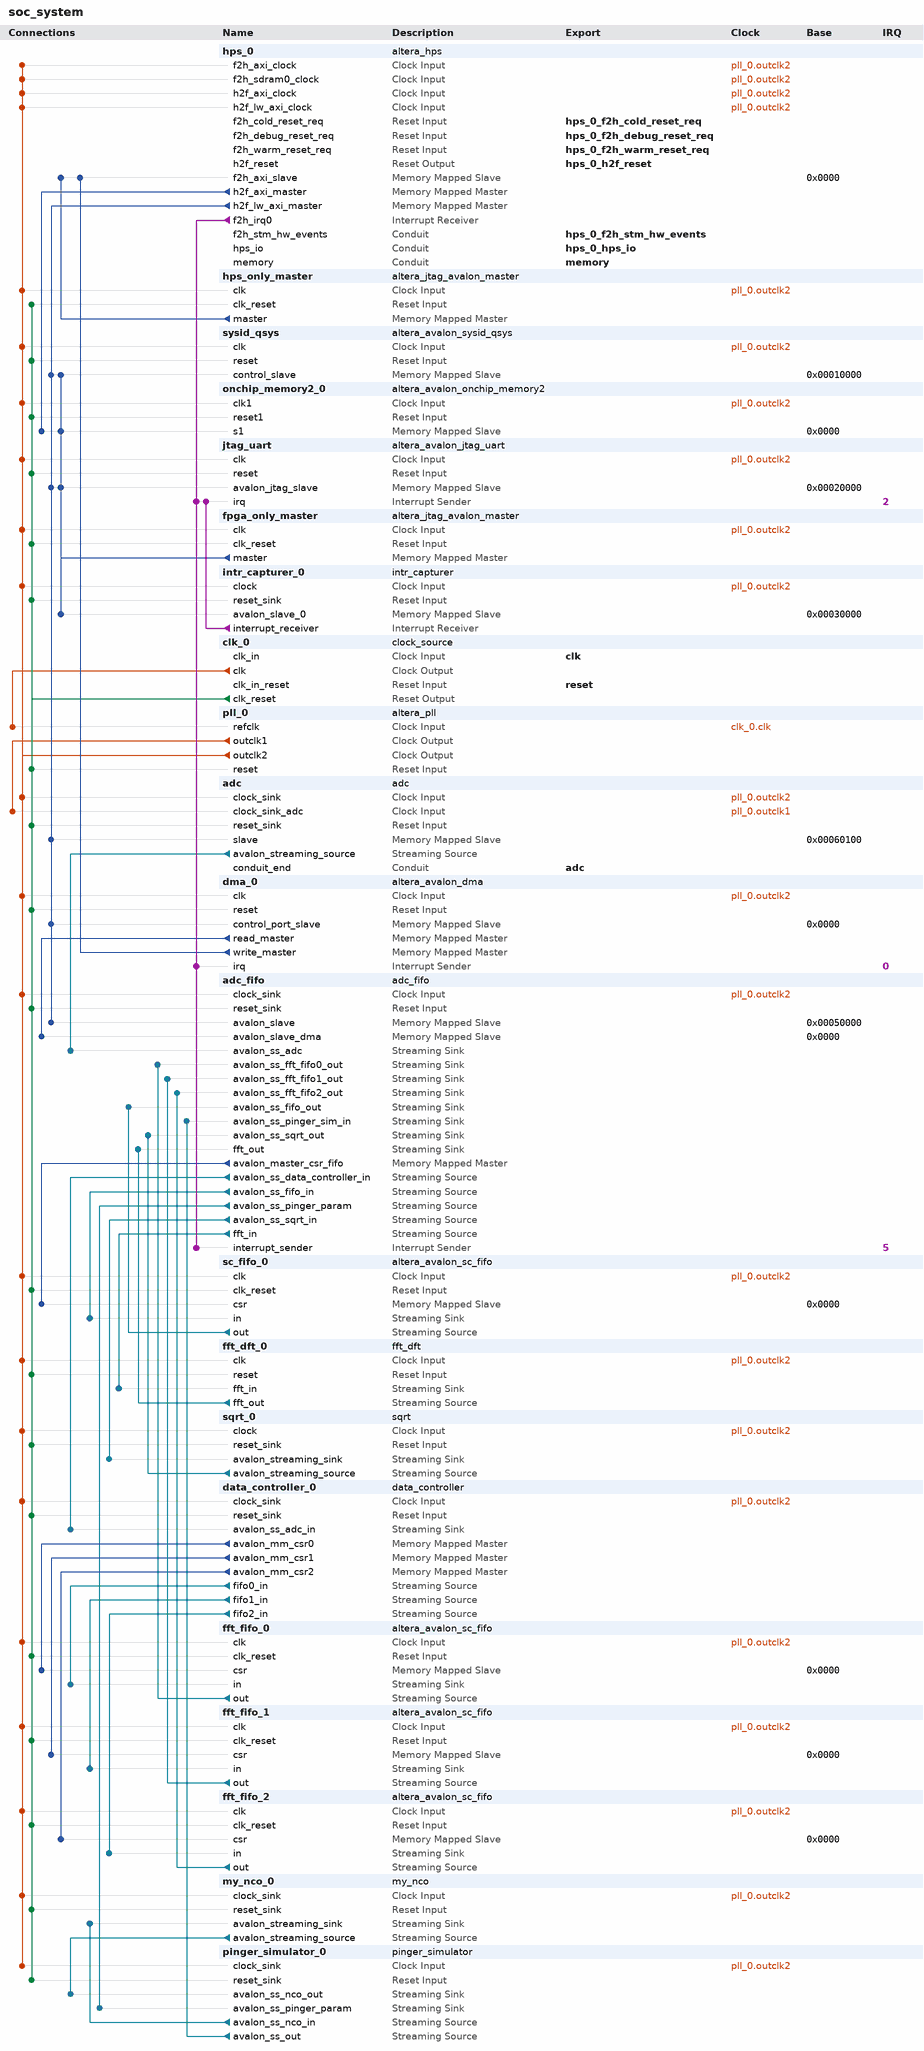
[diagram p0: system contents]
# Platform Designer (Qsys) system soc_system, Cyclone V 5CSEMA4U23C6
# Parameters at their usual value, and those the tool derives, are not listed.
package require -exact qsys 17.1
create_system soc_system
set_project_property DEVICE_FAMILY {Cyclone V}
set_project_property DEVICE 5CSEMA4U23C6

add_instance hps_0 altera_hps 17.1
set_instance_parameter_value hps_0 EMAC1_Mode RGMII
set_instance_parameter_value hps_0 EMAC1_PinMuxing {HPS I/O Set 0}
set_instance_parameter_value hps_0 F2SCLK_COLDRST_Enable true
set_instance_parameter_value hps_0 F2SCLK_DBGRST_Enable true
set_instance_parameter_value hps_0 F2SCLK_WARMRST_Enable true
set_instance_parameter_value hps_0 F2SDRAM_Type {Avalon-MM Write-Only}
set_instance_parameter_value hps_0 F2SDRAM_Width 64
set_instance_parameter_value hps_0 F2SINTERRUPT_Enable true
set_instance_parameter_value hps_0 F2S_Width 3
set_instance_parameter_value hps_0 FPGA_PERIPHERAL_OUTPUT_CLOCK_FREQ_EMAC0_GTX_CLK 100
set_instance_parameter_value hps_0 FPGA_PERIPHERAL_OUTPUT_CLOCK_FREQ_EMAC0_MD_CLK 100.0
set_instance_parameter_value hps_0 FPGA_PERIPHERAL_OUTPUT_CLOCK_FREQ_EMAC1_GTX_CLK 100
set_instance_parameter_value hps_0 FPGA_PERIPHERAL_OUTPUT_CLOCK_FREQ_EMAC1_MD_CLK 100.0
set_instance_parameter_value hps_0 HPS_PROTOCOL DDR3
set_instance_parameter_value hps_0 I2C0_Mode I2C
set_instance_parameter_value hps_0 I2C0_PinMuxing {HPS I/O Set 0}
set_instance_parameter_value hps_0 I2C1_Mode I2C
set_instance_parameter_value hps_0 I2C1_PinMuxing {HPS I/O Set 0}
set_instance_parameter_value hps_0 LWH2F_Enable true
set_instance_parameter_value hps_0 MEM_BANKADDR_WIDTH 3
set_instance_parameter_value hps_0 MEM_CLK_FREQ 400.0
set_instance_parameter_value hps_0 MEM_COL_ADDR_WIDTH 10
set_instance_parameter_value hps_0 MEM_DQ_WIDTH 32
set_instance_parameter_value hps_0 MEM_DRV_STR RZQ/6
set_instance_parameter_value hps_0 MEM_ROW_ADDR_WIDTH 15
set_instance_parameter_value hps_0 MEM_RTT_NOM RZQ/6
set_instance_parameter_value hps_0 MEM_RTT_WR {Dynamic ODT off}
set_instance_parameter_value hps_0 MEM_TCL 7
set_instance_parameter_value hps_0 MEM_TFAW_NS 37.5
set_instance_parameter_value hps_0 MEM_TRAS_NS 35.0
set_instance_parameter_value hps_0 MEM_TRCD_NS 13.75
set_instance_parameter_value hps_0 MEM_TRFC_NS 300.0
set_instance_parameter_value hps_0 MEM_TRP_NS 13.75
set_instance_parameter_value hps_0 MEM_VENDOR Other
set_instance_parameter_value hps_0 MEM_WTCL 7
set_instance_parameter_value hps_0 QSPI_Mode N/A
set_instance_parameter_value hps_0 QSPI_PinMuxing Unused
set_instance_parameter_value hps_0 REF_CLK_FREQ 25.0
set_instance_parameter_value hps_0 S2FCLK_USER2CLK 5
set_instance_parameter_value hps_0 S2F_Width 2
set_instance_parameter_value hps_0 SDIO_Mode {4-bit Data}
set_instance_parameter_value hps_0 SDIO_PinMuxing {HPS I/O Set 0}
set_instance_parameter_value hps_0 SPIM1_Mode {Single Slave Select}
set_instance_parameter_value hps_0 SPIM1_PinMuxing {HPS I/O Set 0}
set_instance_parameter_value hps_0 STM_Enable true
set_instance_parameter_value hps_0 TIMING_BOARD_AC_SKEW 0.02
set_instance_parameter_value hps_0 TIMING_BOARD_AC_TO_CK_SKEW 0.0
set_instance_parameter_value hps_0 TIMING_BOARD_DQ_TO_DQS_SKEW 0.0
set_instance_parameter_value hps_0 TIMING_BOARD_MAX_CK_DELAY 0.6
set_instance_parameter_value hps_0 TIMING_BOARD_MAX_DQS_DELAY 0.6
set_instance_parameter_value hps_0 TIMING_BOARD_SKEW_BETWEEN_DQS 0.02
set_instance_parameter_value hps_0 TIMING_BOARD_SKEW_CKDQS_DIMM_MAX 0.01
set_instance_parameter_value hps_0 TIMING_BOARD_SKEW_CKDQS_DIMM_MIN -0.01
set_instance_parameter_value hps_0 TIMING_BOARD_SKEW_WITHIN_DQS 0.02
set_instance_parameter_value hps_0 TIMING_TDH 125
set_instance_parameter_value hps_0 TIMING_TDQSCK 400
set_instance_parameter_value hps_0 TIMING_TDQSQ 120
set_instance_parameter_value hps_0 TIMING_TDS 50
set_instance_parameter_value hps_0 TIMING_TIH 250
set_instance_parameter_value hps_0 TIMING_TIS 175
set_instance_parameter_value hps_0 TIMING_TQSH 0.38
set_instance_parameter_value hps_0 UART0_Mode {No Flow Control}
set_instance_parameter_value hps_0 UART0_PinMuxing {HPS I/O Set 0}
set_instance_parameter_value hps_0 USB1_Mode SDR
set_instance_parameter_value hps_0 USB1_PinMuxing {HPS I/O Set 0}
set_instance_parameter_value hps_0 desired_cfg_clk_mhz 100.0
set_instance_parameter_value hps_0 desired_qspi_clk_mhz 370.0

add_instance hps_only_master altera_jtag_avalon_master 17.1

add_instance sysid_qsys altera_avalon_sysid_qsys 17.1
set_instance_parameter_value sysid_qsys id -1395322110

add_instance onchip_memory2_0 altera_avalon_onchip_memory2 17.1
set_instance_parameter_value onchip_memory2_0 dataWidth 64
set_instance_parameter_value onchip_memory2_0 dualPort false
set_instance_parameter_value onchip_memory2_0 initMemContent true
set_instance_parameter_value onchip_memory2_0 initializationFileName onchip_memory2_0
set_instance_parameter_value onchip_memory2_0 memorySize 65536

add_instance jtag_uart altera_avalon_jtag_uart 17.1
set_instance_parameter_value jtag_uart allowMultipleConnections true
set_instance_parameter_value jtag_uart simInteractiveOptions INTERACTIVE_ASCII_OUTPUT

add_instance fpga_only_master altera_jtag_avalon_master 17.1

add_instance intr_capturer_0 intr_capturer 100.99.98.97

add_instance clk_0 clock_source 17.1
set_instance_parameter_value clk_0 clockFrequency 50000000

add_instance pll_0 altera_pll 17.1
set_instance_parameter_value pll_0 gui_device_speed_grade 2
set_instance_parameter_value pll_0 gui_number_of_clocks 3
set_instance_parameter_value pll_0 gui_operation_mode normal
set_instance_parameter_value pll_0 gui_output_clock_frequency0 10.0
set_instance_parameter_value pll_0 gui_output_clock_frequency1 40.0
set_instance_parameter_value pll_0 gui_output_clock_frequency2 100.0
set_instance_parameter_value pll_0 gui_pll_mode {Fractional-N PLL}
set_instance_parameter_value pll_0 gui_reference_clock_frequency 50.0
set_instance_parameter_value pll_0 gui_use_locked false

add_instance adc adc 1.0

add_instance dma_0 altera_avalon_dma 17.1
set_instance_parameter_value dma_0 allowByteTransactions false
set_instance_parameter_value dma_0 allowDoubleWordTransactions false
set_instance_parameter_value dma_0 allowHalfWordTransactions true
set_instance_parameter_value dma_0 allowQuadWordTransactions false
set_instance_parameter_value dma_0 allowWordTransactions false
set_instance_parameter_value dma_0 burstEnable false
set_instance_parameter_value dma_0 fifoDepth 4096
set_instance_parameter_value dma_0 maxBurstSize 32
set_instance_parameter_value dma_0 minimumDmaTransactionRegisterWidth 4

add_instance adc_fifo adc_fifo 1.0

add_instance sc_fifo_0 altera_avalon_sc_fifo 17.1
set_instance_parameter_value sc_fifo_0 BITS_PER_SYMBOL 16
set_instance_parameter_value sc_fifo_0 CHANNEL_WIDTH 8
set_instance_parameter_value sc_fifo_0 ERROR_WIDTH 8
set_instance_parameter_value sc_fifo_0 FIFO_DEPTH 8192
set_instance_parameter_value sc_fifo_0 USE_FILL_LEVEL 1
set_instance_parameter_value sc_fifo_0 USE_MEMORY_BLOCKS 1
set_instance_parameter_value sc_fifo_0 USE_STORE_FORWARD 1

add_instance fft_dft_0 fft_dft 1.0

add_instance sqrt_0 sqrt 1.0
set_instance_parameter_value sqrt_0 b 32

add_instance data_controller_0 data_controller 1.0

add_instance fft_fifo_0 altera_avalon_sc_fifo 17.1
set_instance_parameter_value fft_fifo_0 BITS_PER_SYMBOL 32
set_instance_parameter_value fft_fifo_0 CHANNEL_WIDTH 8
set_instance_parameter_value fft_fifo_0 ERROR_WIDTH 8
set_instance_parameter_value fft_fifo_0 FIFO_DEPTH 256
set_instance_parameter_value fft_fifo_0 USE_FILL_LEVEL 1
set_instance_parameter_value fft_fifo_0 USE_MEMORY_BLOCKS 1
set_instance_parameter_value fft_fifo_0 USE_STORE_FORWARD 1

add_instance fft_fifo_1 altera_avalon_sc_fifo 17.1
set_instance_parameter_value fft_fifo_1 BITS_PER_SYMBOL 32
set_instance_parameter_value fft_fifo_1 CHANNEL_WIDTH 8
set_instance_parameter_value fft_fifo_1 ERROR_WIDTH 8
set_instance_parameter_value fft_fifo_1 FIFO_DEPTH 256
set_instance_parameter_value fft_fifo_1 USE_FILL_LEVEL 1
set_instance_parameter_value fft_fifo_1 USE_MEMORY_BLOCKS 1
set_instance_parameter_value fft_fifo_1 USE_STORE_FORWARD 1

add_instance fft_fifo_2 altera_avalon_sc_fifo 17.1
set_instance_parameter_value fft_fifo_2 BITS_PER_SYMBOL 32
set_instance_parameter_value fft_fifo_2 CHANNEL_WIDTH 8
set_instance_parameter_value fft_fifo_2 ERROR_WIDTH 8
set_instance_parameter_value fft_fifo_2 FIFO_DEPTH 256
set_instance_parameter_value fft_fifo_2 USE_FILL_LEVEL 1
set_instance_parameter_value fft_fifo_2 USE_MEMORY_BLOCKS 1
set_instance_parameter_value fft_fifo_2 USE_STORE_FORWARD 1

add_instance my_nco_0 my_nco 1.0

add_instance pinger_simulator_0 pinger_simulator 1.0

# connections
add_connection clk_0.clk pll_0.refclk clock
add_connection pll_0.outclk1 adc.clock_sink_adc clock
add_connection pll_0.outclk2 adc.clock_sink clock
add_connection pll_0.outclk2 adc_fifo.clock_sink clock
add_connection pll_0.outclk2 data_controller_0.clock_sink clock
add_connection pll_0.outclk2 dma_0.clk clock
add_connection pll_0.outclk2 fft_dft_0.clk clock
add_connection pll_0.outclk2 fft_fifo_0.clk clock
add_connection pll_0.outclk2 fft_fifo_1.clk clock
add_connection pll_0.outclk2 fft_fifo_2.clk clock
add_connection pll_0.outclk2 fpga_only_master.clk clock
add_connection pll_0.outclk2 hps_0.f2h_axi_clock clock
add_connection pll_0.outclk2 hps_0.f2h_sdram0_clock clock
add_connection pll_0.outclk2 hps_0.h2f_axi_clock clock
add_connection pll_0.outclk2 hps_0.h2f_lw_axi_clock clock
add_connection pll_0.outclk2 hps_only_master.clk clock
add_connection pll_0.outclk2 intr_capturer_0.clock clock
add_connection pll_0.outclk2 jtag_uart.clk clock
add_connection pll_0.outclk2 my_nco_0.clock_sink clock
add_connection pll_0.outclk2 onchip_memory2_0.clk1 clock
add_connection pll_0.outclk2 pinger_simulator_0.clock_sink clock
add_connection pll_0.outclk2 sc_fifo_0.clk clock
add_connection pll_0.outclk2 sqrt_0.clock clock
add_connection pll_0.outclk2 sysid_qsys.clk clock
add_connection clk_0.clk_reset adc.reset_sink reset
add_connection clk_0.clk_reset adc_fifo.reset_sink reset
add_connection clk_0.clk_reset data_controller_0.reset_sink reset
add_connection clk_0.clk_reset dma_0.reset reset
add_connection clk_0.clk_reset fft_dft_0.reset reset
add_connection clk_0.clk_reset fft_fifo_0.clk_reset reset
add_connection clk_0.clk_reset fft_fifo_1.clk_reset reset
add_connection clk_0.clk_reset fft_fifo_2.clk_reset reset
add_connection clk_0.clk_reset fpga_only_master.clk_reset reset
add_connection clk_0.clk_reset hps_only_master.clk_reset reset
add_connection clk_0.clk_reset intr_capturer_0.reset_sink reset
add_connection clk_0.clk_reset jtag_uart.reset reset
add_connection clk_0.clk_reset my_nco_0.reset_sink reset
add_connection clk_0.clk_reset onchip_memory2_0.reset1 reset
add_connection clk_0.clk_reset pinger_simulator_0.reset_sink reset
add_connection clk_0.clk_reset pll_0.reset reset
add_connection clk_0.clk_reset sc_fifo_0.clk_reset reset
add_connection clk_0.clk_reset sqrt_0.reset_sink reset
add_connection clk_0.clk_reset sysid_qsys.reset reset
add_connection adc_fifo.avalon_master_csr_fifo sc_fifo_0.csr avalon
set_connection_parameter_value adc_fifo.avalon_master_csr_fifo/sc_fifo_0.csr baseAddress 0x0000
add_connection data_controller_0.avalon_mm_csr0 fft_fifo_0.csr avalon
set_connection_parameter_value data_controller_0.avalon_mm_csr0/fft_fifo_0.csr baseAddress 0x0000
add_connection data_controller_0.avalon_mm_csr1 fft_fifo_1.csr avalon
set_connection_parameter_value data_controller_0.avalon_mm_csr1/fft_fifo_1.csr baseAddress 0x0000
add_connection data_controller_0.avalon_mm_csr2 fft_fifo_2.csr avalon
set_connection_parameter_value data_controller_0.avalon_mm_csr2/fft_fifo_2.csr baseAddress 0x0000
add_connection dma_0.read_master adc_fifo.avalon_slave_dma avalon
set_connection_parameter_value dma_0.read_master/adc_fifo.avalon_slave_dma baseAddress 0x0000
add_connection dma_0.write_master hps_0.f2h_axi_slave avalon
set_connection_parameter_value dma_0.write_master/hps_0.f2h_axi_slave baseAddress 0x0000
add_connection fpga_only_master.master intr_capturer_0.avalon_slave_0 avalon
set_connection_parameter_value fpga_only_master.master/intr_capturer_0.avalon_slave_0 baseAddress 0x00030000
add_connection fpga_only_master.master jtag_uart.avalon_jtag_slave avalon
set_connection_parameter_value fpga_only_master.master/jtag_uart.avalon_jtag_slave baseAddress 0x00020000
add_connection fpga_only_master.master onchip_memory2_0.s1 avalon
set_connection_parameter_value fpga_only_master.master/onchip_memory2_0.s1 baseAddress 0x0000
add_connection fpga_only_master.master sysid_qsys.control_slave avalon
set_connection_parameter_value fpga_only_master.master/sysid_qsys.control_slave baseAddress 0x00010000
add_connection hps_0.h2f_axi_master onchip_memory2_0.s1 avalon
set_connection_parameter_value hps_0.h2f_axi_master/onchip_memory2_0.s1 baseAddress 0x0000
add_connection hps_0.h2f_lw_axi_master adc.slave avalon
set_connection_parameter_value hps_0.h2f_lw_axi_master/adc.slave baseAddress 0x00060100
add_connection hps_0.h2f_lw_axi_master adc_fifo.avalon_slave avalon
set_connection_parameter_value hps_0.h2f_lw_axi_master/adc_fifo.avalon_slave baseAddress 0x00050000
add_connection hps_0.h2f_lw_axi_master dma_0.control_port_slave avalon
set_connection_parameter_value hps_0.h2f_lw_axi_master/dma_0.control_port_slave baseAddress 0x0000
add_connection hps_0.h2f_lw_axi_master jtag_uart.avalon_jtag_slave avalon
set_connection_parameter_value hps_0.h2f_lw_axi_master/jtag_uart.avalon_jtag_slave baseAddress 0x00020000
add_connection hps_0.h2f_lw_axi_master sysid_qsys.control_slave avalon
set_connection_parameter_value hps_0.h2f_lw_axi_master/sysid_qsys.control_slave baseAddress 0x00010000
add_connection hps_only_master.master hps_0.f2h_axi_slave avalon
set_connection_parameter_value hps_only_master.master/hps_0.f2h_axi_slave baseAddress 0x0000
add_connection adc.avalon_streaming_source adc_fifo.avalon_ss_adc avalon_streaming
add_connection adc_fifo.avalon_ss_data_controller_in data_controller_0.avalon_ss_adc_in avalon_streaming
add_connection adc_fifo.avalon_ss_fifo_in sc_fifo_0.in avalon_streaming
add_connection adc_fifo.avalon_ss_pinger_param pinger_simulator_0.avalon_ss_pinger_param avalon_streaming
add_connection adc_fifo.avalon_ss_sqrt_in sqrt_0.avalon_streaming_sink avalon_streaming
add_connection adc_fifo.fft_in fft_dft_0.fft_in avalon_streaming
add_connection data_controller_0.fifo0_in fft_fifo_0.in avalon_streaming
add_connection data_controller_0.fifo1_in fft_fifo_1.in avalon_streaming
add_connection data_controller_0.fifo2_in fft_fifo_2.in avalon_streaming
add_connection fft_dft_0.fft_out adc_fifo.fft_out avalon_streaming
add_connection fft_fifo_0.out adc_fifo.avalon_ss_fft_fifo0_out avalon_streaming
add_connection fft_fifo_1.out adc_fifo.avalon_ss_fft_fifo1_out avalon_streaming
add_connection fft_fifo_2.out adc_fifo.avalon_ss_fft_fifo2_out avalon_streaming
add_connection my_nco_0.avalon_streaming_source pinger_simulator_0.avalon_ss_nco_out avalon_streaming
add_connection pinger_simulator_0.avalon_ss_nco_in my_nco_0.avalon_streaming_sink avalon_streaming
add_connection pinger_simulator_0.avalon_ss_out adc_fifo.avalon_ss_pinger_sim_in avalon_streaming
add_connection sc_fifo_0.out adc_fifo.avalon_ss_fifo_out avalon_streaming
add_connection sqrt_0.avalon_streaming_source adc_fifo.avalon_ss_sqrt_out avalon_streaming
add_connection hps_0.f2h_irq0 adc_fifo.interrupt_sender interrupt
set_connection_parameter_value hps_0.f2h_irq0/adc_fifo.interrupt_sender irqNumber 5
add_connection hps_0.f2h_irq0 dma_0.irq interrupt
set_connection_parameter_value hps_0.f2h_irq0/dma_0.irq irqNumber 0
add_connection hps_0.f2h_irq0 jtag_uart.irq interrupt
set_connection_parameter_value hps_0.f2h_irq0/jtag_uart.irq irqNumber 2
add_connection intr_capturer_0.interrupt_receiver jtag_uart.irq interrupt
set_connection_parameter_value intr_capturer_0.interrupt_receiver/jtag_uart.irq irqNumber 2

# exported interfaces
add_interface adc conduit end
set_interface_property adc EXPORT_OF adc.conduit_end
add_interface clk clock sink
set_interface_property clk EXPORT_OF clk_0.clk_in
add_interface hps_0_f2h_cold_reset_req reset sink
set_interface_property hps_0_f2h_cold_reset_req EXPORT_OF hps_0.f2h_cold_reset_req
add_interface hps_0_f2h_debug_reset_req reset sink
set_interface_property hps_0_f2h_debug_reset_req EXPORT_OF hps_0.f2h_debug_reset_req
add_interface hps_0_f2h_stm_hw_events conduit end
set_interface_property hps_0_f2h_stm_hw_events EXPORT_OF hps_0.f2h_stm_hw_events
add_interface hps_0_f2h_warm_reset_req reset sink
set_interface_property hps_0_f2h_warm_reset_req EXPORT_OF hps_0.f2h_warm_reset_req
add_interface hps_0_h2f_reset reset source
set_interface_property hps_0_h2f_reset EXPORT_OF hps_0.h2f_reset
add_interface hps_0_hps_io conduit end
set_interface_property hps_0_hps_io EXPORT_OF hps_0.hps_io
add_interface memory conduit end
set_interface_property memory EXPORT_OF hps_0.memory
add_interface reset reset sink
set_interface_property reset EXPORT_OF clk_0.clk_in_reset

set_interconnect_requirement {$system} qsys_mm.clockCrossingAdapter HANDSHAKE
set_interconnect_requirement {$system} qsys_mm.maxAdditionalLatency 1

save_system soc_system.qsys
